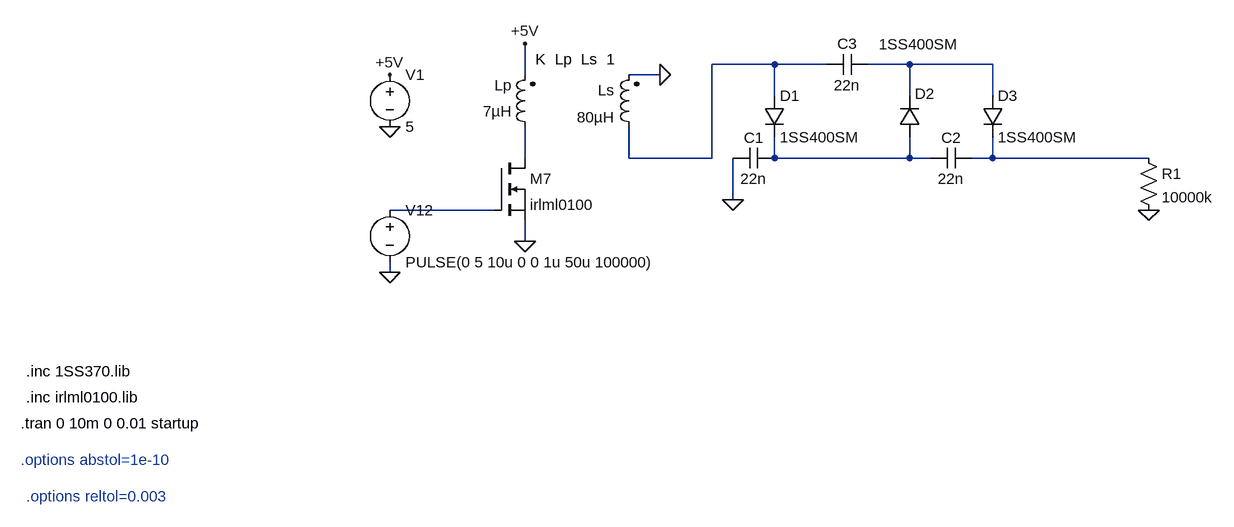
[diagram p0: schematic hvconv.asc]
hvconv.asc, the LTspice schematic file:
Version 4
SHEET 1 3336 788
WIRE 1136 -1264 1040 -1264
WIRE 1216 -1264 1136 -1264
WIRE 1344 -1264 1280 -1264
WIRE 1472 -1264 1344 -1264
WIRE 752 -1248 752 -1296
WIRE 960 -1248 912 -1248
WIRE 1136 -1216 1136 -1264
WIRE 1344 -1216 1344 -1264
WIRE 1472 -1216 1472 -1264
WIRE 752 -1120 752 -1168
WIRE 912 -1120 912 -1168
WIRE 1040 -1120 1040 -1264
WIRE 1040 -1120 912 -1120
WIRE 1136 -1120 1136 -1152
WIRE 1344 -1120 1344 -1152
WIRE 1344 -1120 1136 -1120
WIRE 1376 -1120 1344 -1120
WIRE 1472 -1120 1472 -1152
WIRE 1472 -1120 1440 -1120
WIRE 1712 -1120 1472 -1120
WIRE 1072 -1056 1072 -1120
WIRE 704 -1040 544 -1040
WIRE 752 -992 752 -1024
WIRE 544 -944 544 -960
FLAG 544 -1168 0
FLAG 544 -1248 +5V
FLAG 752 -1296 +5V
FLAG 752 -992 0
FLAG 544 -944 0
FLAG 960 -1248 0
FLAG 1072 -1056 0
FLAG 1712 -1040 0
SYMBOL voltage 544 -1264 R0
WINDOW 123 0 0 Left 0
WINDOW 39 0 0 Left 0
SYMATTR InstName V1
SYMATTR Value 5
SYMBOL voltage 544 -1056 R0
WINDOW 123 0 0 Left 0
WINDOW 39 0 0 Left 0
SYMATTR InstName V12
SYMATTR Value PULSE(0 5 10u 0 0 1u 50u 100000)
SYMBOL ind2 768 -1152 R180
WINDOW 0 36 80 Left 2
WINDOW 3 36 40 Left 2
SYMATTR InstName Lp
SYMATTR Value 7µH
SYMATTR Type ind
SYMATTR SpiceLine Rser=0.5 Cpar=0
SYMBOL ind2 928 -1152 R180
WINDOW 0 38 72 Left 2
WINDOW 3 38 31 Left 2
SYMATTR InstName Ls
SYMATTR Value 80µH
SYMATTR Type ind
SYMATTR SpiceLine Rser=60 Cpar=0
SYMBOL nmos 704 -1120 R0
SYMATTR InstName M7
SYMATTR Value irlml0100
SYMATTR Prefix X
SYMBOL cap 1136 -1136 R90
WINDOW 0 0 32 VBottom 2
WINDOW 3 32 32 VTop 2
SYMATTR InstName C1
SYMATTR Value 22n
SYMBOL cap 1440 -1136 R90
WINDOW 0 0 32 VBottom 2
WINDOW 3 32 32 VTop 2
SYMATTR InstName C2
SYMATTR Value 22n
SYMBOL cap 1280 -1280 R90
WINDOW 0 0 32 VBottom 2
WINDOW 3 32 32 VTop 2
SYMATTR InstName C3
SYMATTR Value 22n
SYMBOL diode 1120 -1216 R0
SYMATTR InstName D1
SYMATTR Value 1SS400SM
SYMBOL diode 1360 -1152 R180
WINDOW 0 -23 67 Left 2
WINDOW 3 -58 143 Left 2
SYMATTR InstName D2
SYMATTR Value 1SS400SM
SYMBOL diode 1456 -1216 R0
SYMATTR InstName D3
SYMATTR Value 1SS400SM
SYMBOL res 1696 -1136 R0
SYMATTR InstName R1
SYMATTR Value 10000k
TEXT -24 -712 Left 2 !.tran 0 10m 0 0.01 startup
TEXT -24 -656 Left 2 ;.options abstol=1e-10
TEXT -16 -600 Left 2 ;.options reltol=0.003
TEXT -16 -752 Left 2 !.inc irlml0100.lib
TEXT 768 -1272 Left 2 !K  Lp  Ls  1
TEXT -16 -792 Left 2 !.inc 1SS370.lib

The netlist it stands for:
* hvconv.asc
V1 +5V 0 5
V12 N006 0 PULSE(0 5 10u 0 0 1u 50u 100000)
Lp N003 +5V 7µH Rser=0.5 Cpar=0
Ls N001 0 80µH Rser=60 Cpar=0
XM7 N003 N006 0 irlml0100  ; pins D G S
C1 N004 0 22n
C2 N005 N004 22n
C3 N002 N001 22n
D1 N001 N004 1SS400SM
D2 N004 N002 1SS400SM
D3 N002 N005 1SS400SM
R1 N005 0 10000k
.model D D
.lib standard.dio
.tran 0 10m 0 0.01 startup
* .options abstol=1e-10
* .options reltol=0.003
.inc irlml0100.lib
K  Lp  Ls  1
.inc 1SS370.lib
.backanno
.end